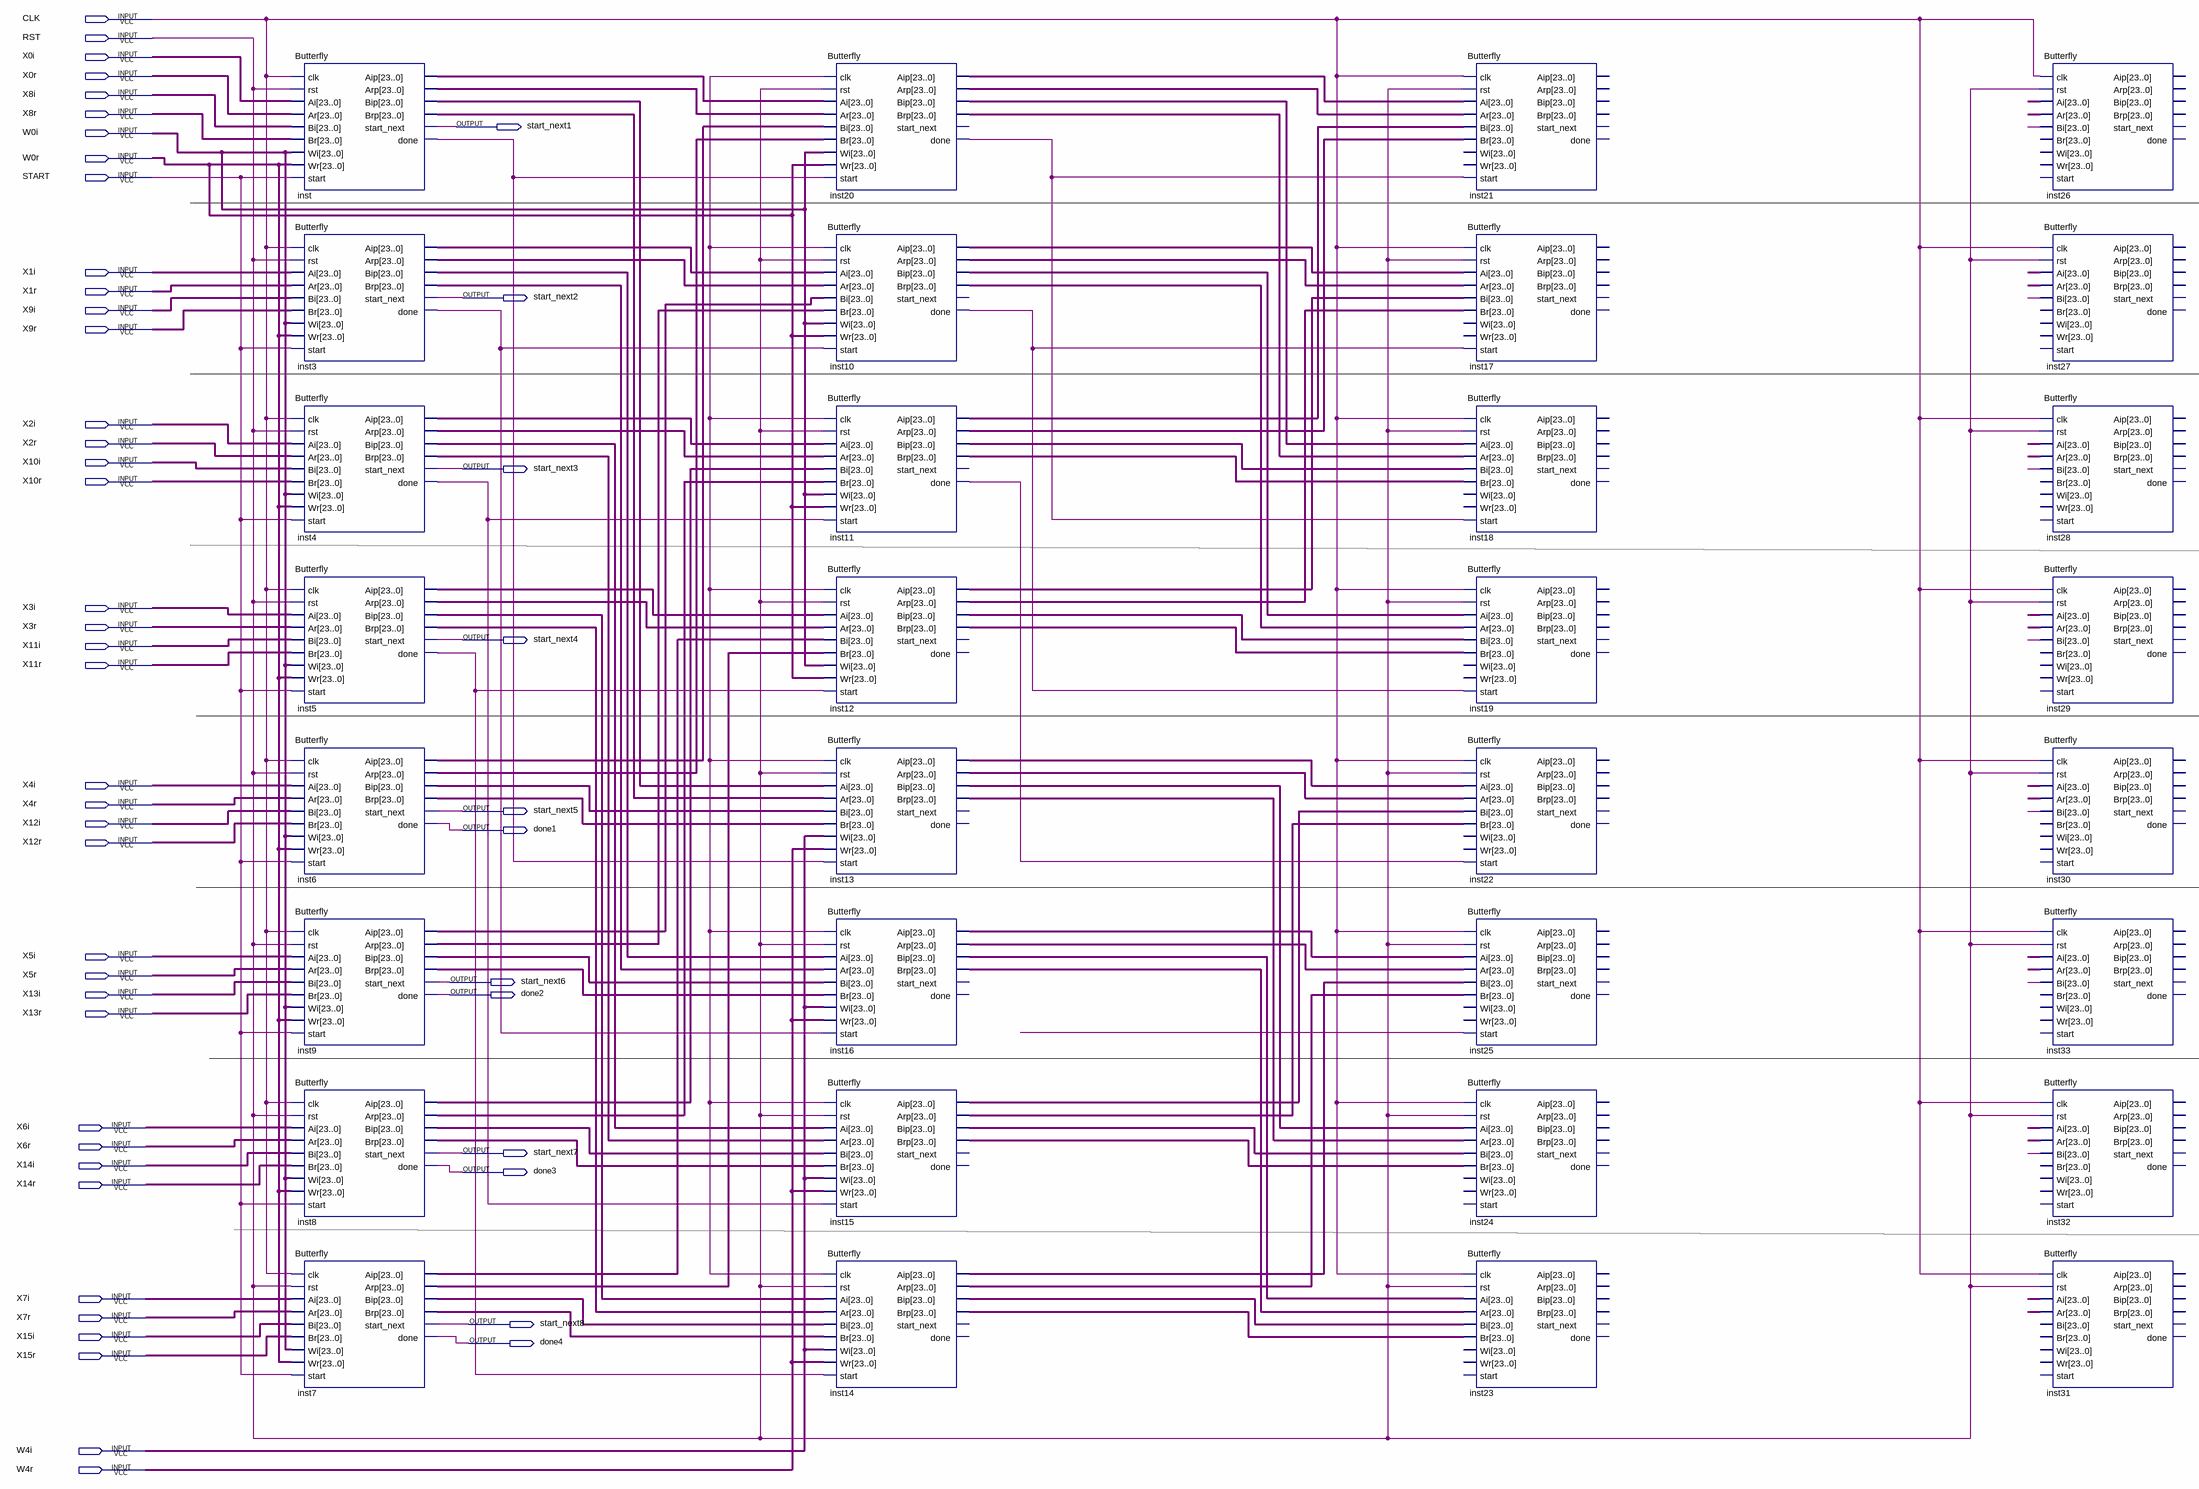
[diagram p0: schematic sheet]
// Quartus schematic OperazioneSanSilvestro.bdf as structural Verilog: 32 symbols, 51 pins
module OperazioneSanSilvestro (
  input  CLK,
  input  RST,
  input  X0i,
  input  X0r,
  input  X8i,
  input  X8r,
  input  W0i,
  input  W0r,
  input  START,
  input  X1i,
  input  X1r,
  input  X9i,
  input  X9r,
  input  X2i,
  input  X2r,
  input  X10i,
  input  X10r,
  input  X3i,
  input  X3r,
  input  X11i,
  input  X11r,
  input  X4i,
  input  X4r,
  input  X12i,
  input  X12r,
  input  X5i,
  input  X5r,
  input  X13i,
  input  X13r,
  input  X6i,
  input  X6r,
  input  X14i,
  input  X14r,
  input  X7i,
  input  X7r,
  input  X15i,
  input  X15r,
  input  W4i,
  input  W4r,
  output start_next1,
  output start_next2,
  output start_next3,
  output start_next4,
  output start_next5,
  output done1,
  output start_next6,
  output done2,
  output start_next7,
  output done3,
  output start_next8,
  output done4
);

  wire inst3_done, inst4_done, inst5_done, inst10_done, inst11_done, inst20_done, inst_done, undriven_3,
       undriven_6, undriven_9, undriven_12, undriven_17, undriven_19, undriven_23, undriven_56, undriven_61;
  wire [23:0] inst3_aip, inst3_arp, inst3_bip, inst3_brp, inst4_aip, inst4_arp, inst4_bip, inst4_brp,
       inst5_aip, inst5_arp, inst5_bip, inst5_brp, inst6_aip, inst6_arp, inst6_bip, inst6_brp, inst7_aip,
       inst7_arp, inst7_bip, inst7_brp, inst8_aip, inst8_arp, inst8_bip, inst8_brp, inst9_aip, inst9_arp,
       inst9_bip, inst9_brp, inst10_aip, inst10_arp, inst10_bip, inst10_brp, inst11_aip, inst11_arp,
       inst11_bip, inst11_brp, inst12_aip, inst12_arp, inst12_bip, inst12_brp, inst13_aip, inst13_arp,
       inst13_bip, inst13_brp, inst14_aip, inst14_arp, inst14_bip, inst14_brp, inst15_aip, inst15_arp,
       inst15_bip, inst15_brp, inst16_aip, inst16_arp, inst16_bip, inst16_brp, inst20_aip, inst20_arp,
       inst20_bip, inst20_brp, inst_aip, inst_arp, inst_bip, inst_brp, undriven, undriven_2, undriven_4,
       undriven_5, undriven_7, undriven_8, undriven_10, undriven_11, undriven_13, undriven_14, undriven_15,
       undriven_16, undriven_18, undriven_20, undriven_21, undriven_22, undriven_24, undriven_25,
       undriven_26, undriven_27, undriven_28, undriven_29, undriven_30, undriven_31, undriven_32,
       undriven_33, undriven_34, undriven_35, undriven_36, undriven_37, undriven_38, undriven_39,
       undriven_40, undriven_41, undriven_42, undriven_43, undriven_44, undriven_45, undriven_46,
       undriven_47, undriven_48, undriven_49, undriven_50, undriven_51, undriven_52, undriven_53,
       undriven_54, undriven_55, undriven_57, undriven_58, undriven_59, undriven_60;

  Butterfly inst (
    .clk(CLK), .rst(RST), .Ai(undriven_24), .Ar(undriven_25), .Bi(undriven_26), .Br(undriven_27),
    .Wi(undriven_57), .Wr(undriven_58), .start(START), .Aip(inst_aip), .Arp(inst_arp), .Bip(inst_bip),
    .Brp(inst_brp), .start_next(start_next1), .done(inst_done));
  Butterfly inst3 (
    .clk(CLK), .rst(RST), .Ai(undriven_28), .Ar(undriven_29), .Bi(undriven_30), .Br(undriven_31),
    .Wi(undriven_57), .Wr(undriven_58), .start(START), .Aip(inst3_aip), .Arp(inst3_arp), .Bip(inst3_bip),
    .Brp(inst3_brp), .start_next(start_next2), .done(inst3_done));
  Butterfly inst4 (
    .clk(CLK), .rst(RST), .Ai(undriven_32), .Ar(undriven_33), .Bi(undriven_34), .Br(undriven_35),
    .Wi(undriven_57), .Wr(undriven_58), .start(START), .Aip(inst4_aip), .Arp(inst4_arp), .Bip(inst4_bip),
    .Brp(inst4_brp), .start_next(start_next3), .done(inst4_done));
  Butterfly inst5 (
    .clk(CLK), .rst(RST), .Ai(undriven_36), .Ar(undriven_38), .Bi(undriven_37), .Br(undriven_39),
    .Wi(undriven_57), .Wr(undriven_58), .start(START), .Aip(inst5_aip), .Arp(inst5_arp), .Bip(inst5_bip),
    .Brp(inst5_brp), .start_next(start_next4), .done(inst5_done));
  Butterfly inst6 (
    .clk(CLK), .rst(RST), .Ai(undriven_40), .Ar(undriven_41), .Bi(undriven_43), .Br(undriven_42),
    .Wi(undriven_57), .Wr(undriven_58), .start(START), .Aip(inst6_aip), .Arp(inst6_arp), .Bip(inst6_bip),
    .Brp(inst6_brp), .start_next(start_next5), .done(done1));
  Butterfly inst9 (
    .clk(CLK), .rst(RST), .Ai(undriven_44), .Ar(undriven_45), .Bi(undriven_46), .Br(undriven_47),
    .Wi(undriven_57), .Wr(undriven_58), .start(START), .Aip(inst9_aip), .Arp(inst9_arp), .Bip(inst9_bip),
    .Brp(inst9_brp), .start_next(start_next6), .done(done2));
  Butterfly inst8 (
    .clk(CLK), .rst(RST), .Ai(undriven_48), .Ar(undriven_49), .Bi(undriven_50), .Br(undriven_51),
    .Wi(undriven_57), .Wr(undriven_58), .start(START), .Aip(inst8_aip), .Arp(inst8_arp), .Bip(inst8_bip),
    .Brp(inst8_brp), .start_next(start_next7), .done(done3));
  Butterfly inst7 (
    .clk(CLK), .rst(RST), .Ai(undriven_52), .Ar(undriven_53), .Bi(undriven_54), .Br(undriven_55),
    .Wi(undriven_57), .Wr(undriven_58), .start(START), .Aip(inst7_aip), .Arp(inst7_arp), .Bip(inst7_bip),
    .Brp(inst7_brp), .start_next(start_next8), .done(done4));
  Butterfly inst20 (
    .clk(undriven_56), .rst(RST), .Ai(inst_aip), .Ar(inst_arp), .Bi(inst6_aip), .Br(inst6_arp),
    .Wi(undriven_57), .Wr(undriven_58), .start(inst_done), .Aip(inst20_aip), .Arp(inst20_arp),
    .Bip(inst20_bip), .Brp(inst20_brp), .done(inst20_done));  // open: start_next
  Butterfly inst10 (
    .clk(undriven_56), .rst(RST), .Ai(inst3_aip), .Ar(inst3_arp), .Bi(inst9_aip), .Br(inst9_arp),
    .Wi(undriven_57), .Wr(undriven_58), .start(inst3_done), .Aip(inst10_aip), .Arp(inst10_arp),
    .Bip(inst10_bip), .Brp(inst10_brp), .done(inst10_done));  // open: start_next
  Butterfly inst11 (
    .clk(undriven_56), .rst(RST), .Ai(inst4_aip), .Ar(inst4_arp), .Bi(inst8_aip), .Br(inst8_arp),
    .Wi(undriven_57), .Wr(undriven_58), .start(inst4_done), .Aip(inst11_aip), .Arp(inst11_arp),
    .Bip(inst11_bip), .Brp(inst11_brp), .done(inst11_done));  // open: start_next
  Butterfly inst12 (
    .clk(undriven_56), .rst(RST), .Ai(inst5_aip), .Ar(inst5_arp), .Bi(inst7_aip), .Br(inst7_arp),
    .Wi(undriven_57), .Wr(undriven_58), .start(inst5_done), .Aip(inst12_aip), .Arp(inst12_arp),
    .Bip(inst12_bip), .Brp(inst12_brp));  // open: start_next, done
  Butterfly inst13 (
    .clk(undriven_56), .rst(RST), .Ai(inst_bip), .Ar(inst_brp), .Bi(inst6_bip), .Br(inst6_brp),
    .Wi(undriven_59), .Wr(undriven_60), .start(inst_done), .Aip(inst13_aip), .Arp(inst13_arp),
    .Bip(inst13_bip), .Brp(inst13_brp));  // open: start_next, done
  Butterfly inst16 (
    .clk(undriven_56), .rst(RST), .Ai(inst3_bip), .Ar(inst3_brp), .Bi(inst9_bip), .Br(inst9_brp),
    .Wi(undriven_59), .Wr(undriven_60), .start(inst3_done), .Aip(inst16_aip), .Arp(inst16_arp),
    .Bip(inst16_bip), .Brp(inst16_brp));  // open: start_next, done
  Butterfly inst15 (
    .clk(undriven_56), .rst(RST), .Ai(inst4_bip), .Ar(inst4_brp), .Bi(inst8_bip), .Br(inst8_brp),
    .Wi(undriven_59), .Wr(undriven_60), .start(inst4_done), .Aip(inst15_aip), .Arp(inst15_arp),
    .Bip(inst15_bip), .Brp(inst15_brp));  // open: start_next, done
  Butterfly inst14 (
    .clk(undriven_56), .rst(RST), .Ai(inst5_bip), .Ar(inst5_brp), .Bi(inst7_bip), .Br(inst7_brp),
    .Wi(undriven_59), .Wr(undriven_60), .start(inst5_done), .Aip(inst14_aip), .Arp(inst14_arp),
    .Bip(inst14_bip), .Brp(inst14_brp));  // open: start_next, done
  Butterfly inst21 (
    .clk(CLK), .rst(RST), .Ai(inst20_aip), .Ar(inst20_arp), .Bi(inst11_aip), .Br(inst11_arp),
    .start(inst20_done));  // open: Wi, Wr, Aip, Arp, Bip, Brp, start_next, done
  Butterfly inst17 (
    .clk(CLK), .rst(RST), .Ai(inst10_aip), .Ar(inst10_arp), .Bi(inst12_aip), .Br(inst12_arp),
    .start(inst10_done));  // open: Wi, Wr, Aip, Arp, Bip, Brp, start_next, done
  Butterfly inst18 (
    .clk(CLK), .rst(RST), .Ai(inst20_bip), .Ar(inst20_brp), .Bi(inst11_bip), .Br(inst11_brp),
    .start(inst20_done));  // open: Wi, Wr, Aip, Arp, Bip, Brp, start_next, done
  Butterfly inst19 (
    .clk(CLK), .rst(RST), .Ai(inst10_bip), .Ar(inst10_brp), .Bi(inst12_bip), .Br(inst12_brp),
    .start(inst10_done));  // open: Wi, Wr, Aip, Arp, Bip, Brp, start_next, done
  Butterfly inst22 (
    .clk(CLK), .rst(RST), .Ai(inst13_aip), .Ar(inst13_arp), .Bi(inst15_aip), .Br(inst15_arp),
    .start(inst11_done));  // open: Wi, Wr, Aip, Arp, Bip, Brp, start_next, done
  Butterfly inst25 (
    .clk(CLK), .rst(RST), .Ai(inst16_aip), .Ar(inst16_arp), .Bi(inst14_aip), .Br(inst14_arp),
    .start(undriven_61));  // open: Wi, Wr, Aip, Arp, Bip, Brp, start_next, done
  Butterfly inst24 (
    .clk(CLK), .rst(RST), .Ai(inst13_bip), .Ar(inst13_brp), .Bi(inst15_bip), .Br(inst15_brp));  // open: Wi, Wr, start, Aip, Arp, Bip, Brp, start_next, done
  Butterfly inst23 (
    .clk(CLK), .rst(RST), .Ai(inst16_bip), .Ar(inst16_brp), .Bi(inst14_bip), .Br(inst14_brp));  // open: Wi, Wr, start, Aip, Arp, Bip, Brp, start_next, done
  Butterfly inst26 (
    .clk(CLK), .rst(RST), .Ai(undriven_2), .Ar(undriven), .Bi({24{undriven_3}}));  // open: Br, Wi, Wr, start, Aip, Arp, Bip, Brp, start_next, done
  Butterfly inst27 (
    .clk(CLK), .rst(RST), .Ai(undriven_4), .Ar(undriven_5), .Bi({24{undriven_6}}));  // open: Br, Wi, Wr, start, Aip, Arp, Bip, Brp, start_next, done
  Butterfly inst28 (
    .clk(CLK), .rst(RST), .Ai(undriven_8), .Ar(undriven_7), .Bi({24{undriven_9}}));  // open: Br, Wi, Wr, start, Aip, Arp, Bip, Brp, start_next, done
  Butterfly inst29 (
    .clk(CLK), .rst(RST), .Ai(undriven_10), .Ar(undriven_11), .Bi({24{undriven_12}}));  // open: Br, Wi, Wr, start, Aip, Arp, Bip, Brp, start_next, done
  Butterfly inst30 (
    .clk(CLK), .rst(RST), .Ai(undriven_22), .Ar(undriven_21), .Bi({24{undriven_23}}));  // open: Br, Wi, Wr, start, Aip, Arp, Bip, Brp, start_next, done
  Butterfly inst33 (
    .clk(CLK), .rst(RST), .Ai(undriven_20), .Ar(undriven_18), .Bi({24{undriven_19}}));  // open: Br, Wi, Wr, start, Aip, Arp, Bip, Brp, start_next, done
  Butterfly inst32 (
    .clk(CLK), .rst(RST), .Ai(undriven_15), .Ar(undriven_16), .Bi({24{undriven_17}}));  // open: Br, Wi, Wr, start, Aip, Arp, Bip, Brp, start_next, done
  Butterfly inst31 (
    .clk(CLK), .rst(RST), .Ai(undriven_13), .Ar(undriven_14));  // open: Bi, Br, Wi, Wr, start, Aip, Arp, Bip, Brp, start_next, done
endmodule
